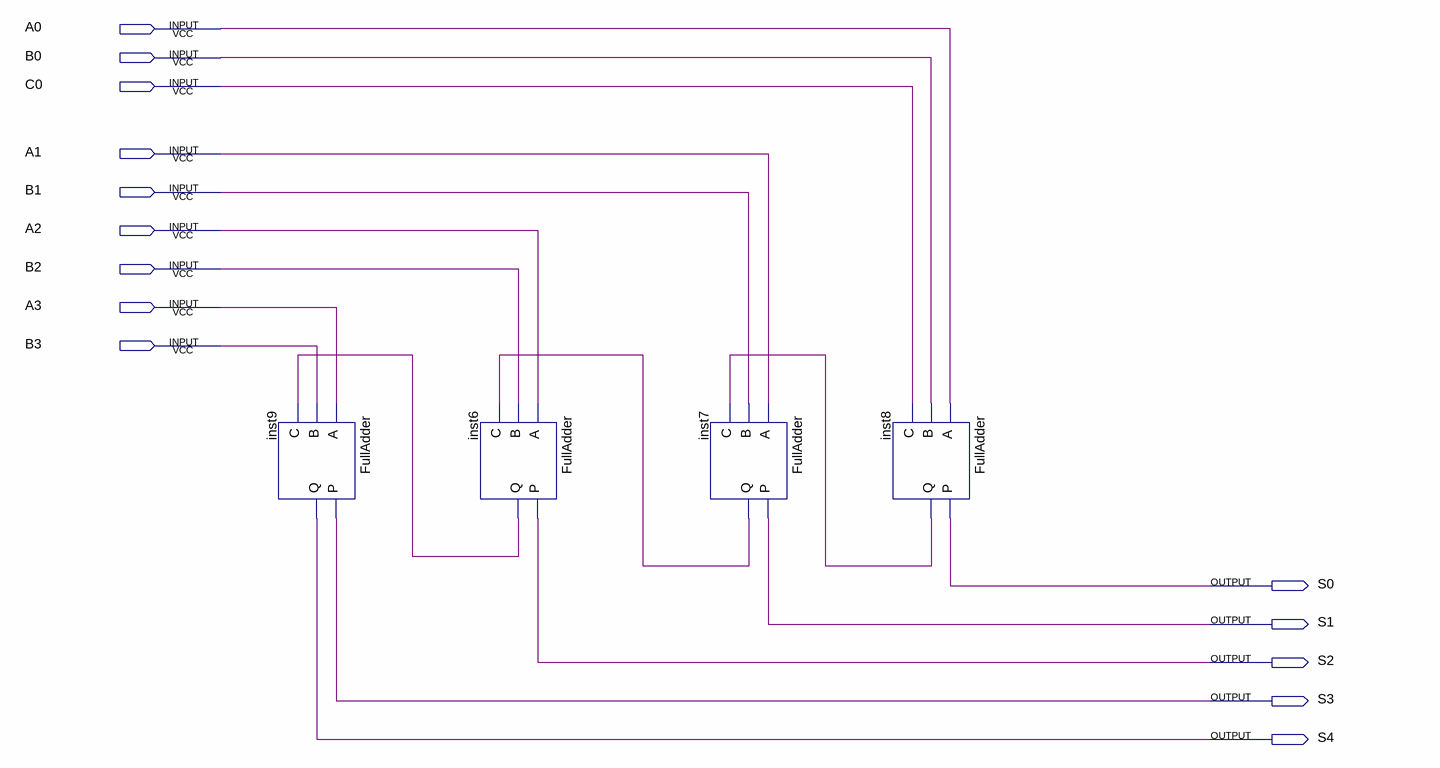
[diagram p0: schematic sheet]
// Quartus schematic RippleCarryAdder.bdf as structural Verilog: 4 symbols, 14 pins
module RippleCarryAdder (
  input  A0,
  input  B0,
  input  C0,
  input  A1,
  input  B1,
  input  A2,
  input  B2,
  input  A3,
  input  B3,
  output S0,
  output S1,
  output S2,
  output S3,
  output S4
);

  wire inst6_q, inst7_q, inst8_q;

  FullAdder inst9 (.A(A3), .B(B3), .C(inst6_q), .P(S3), .Q(S4));
  FullAdder inst6 (.A(A2), .B(B2), .C(inst7_q), .P(S2), .Q(inst6_q));
  FullAdder inst7 (.A(A1), .B(B1), .C(inst8_q), .P(S1), .Q(inst7_q));
  FullAdder inst8 (.A(A0), .B(B0), .C(C0), .P(S0), .Q(inst8_q));
endmodule
